# EAGLE design i2cspilcdbackpack (EAGLE 5.10)
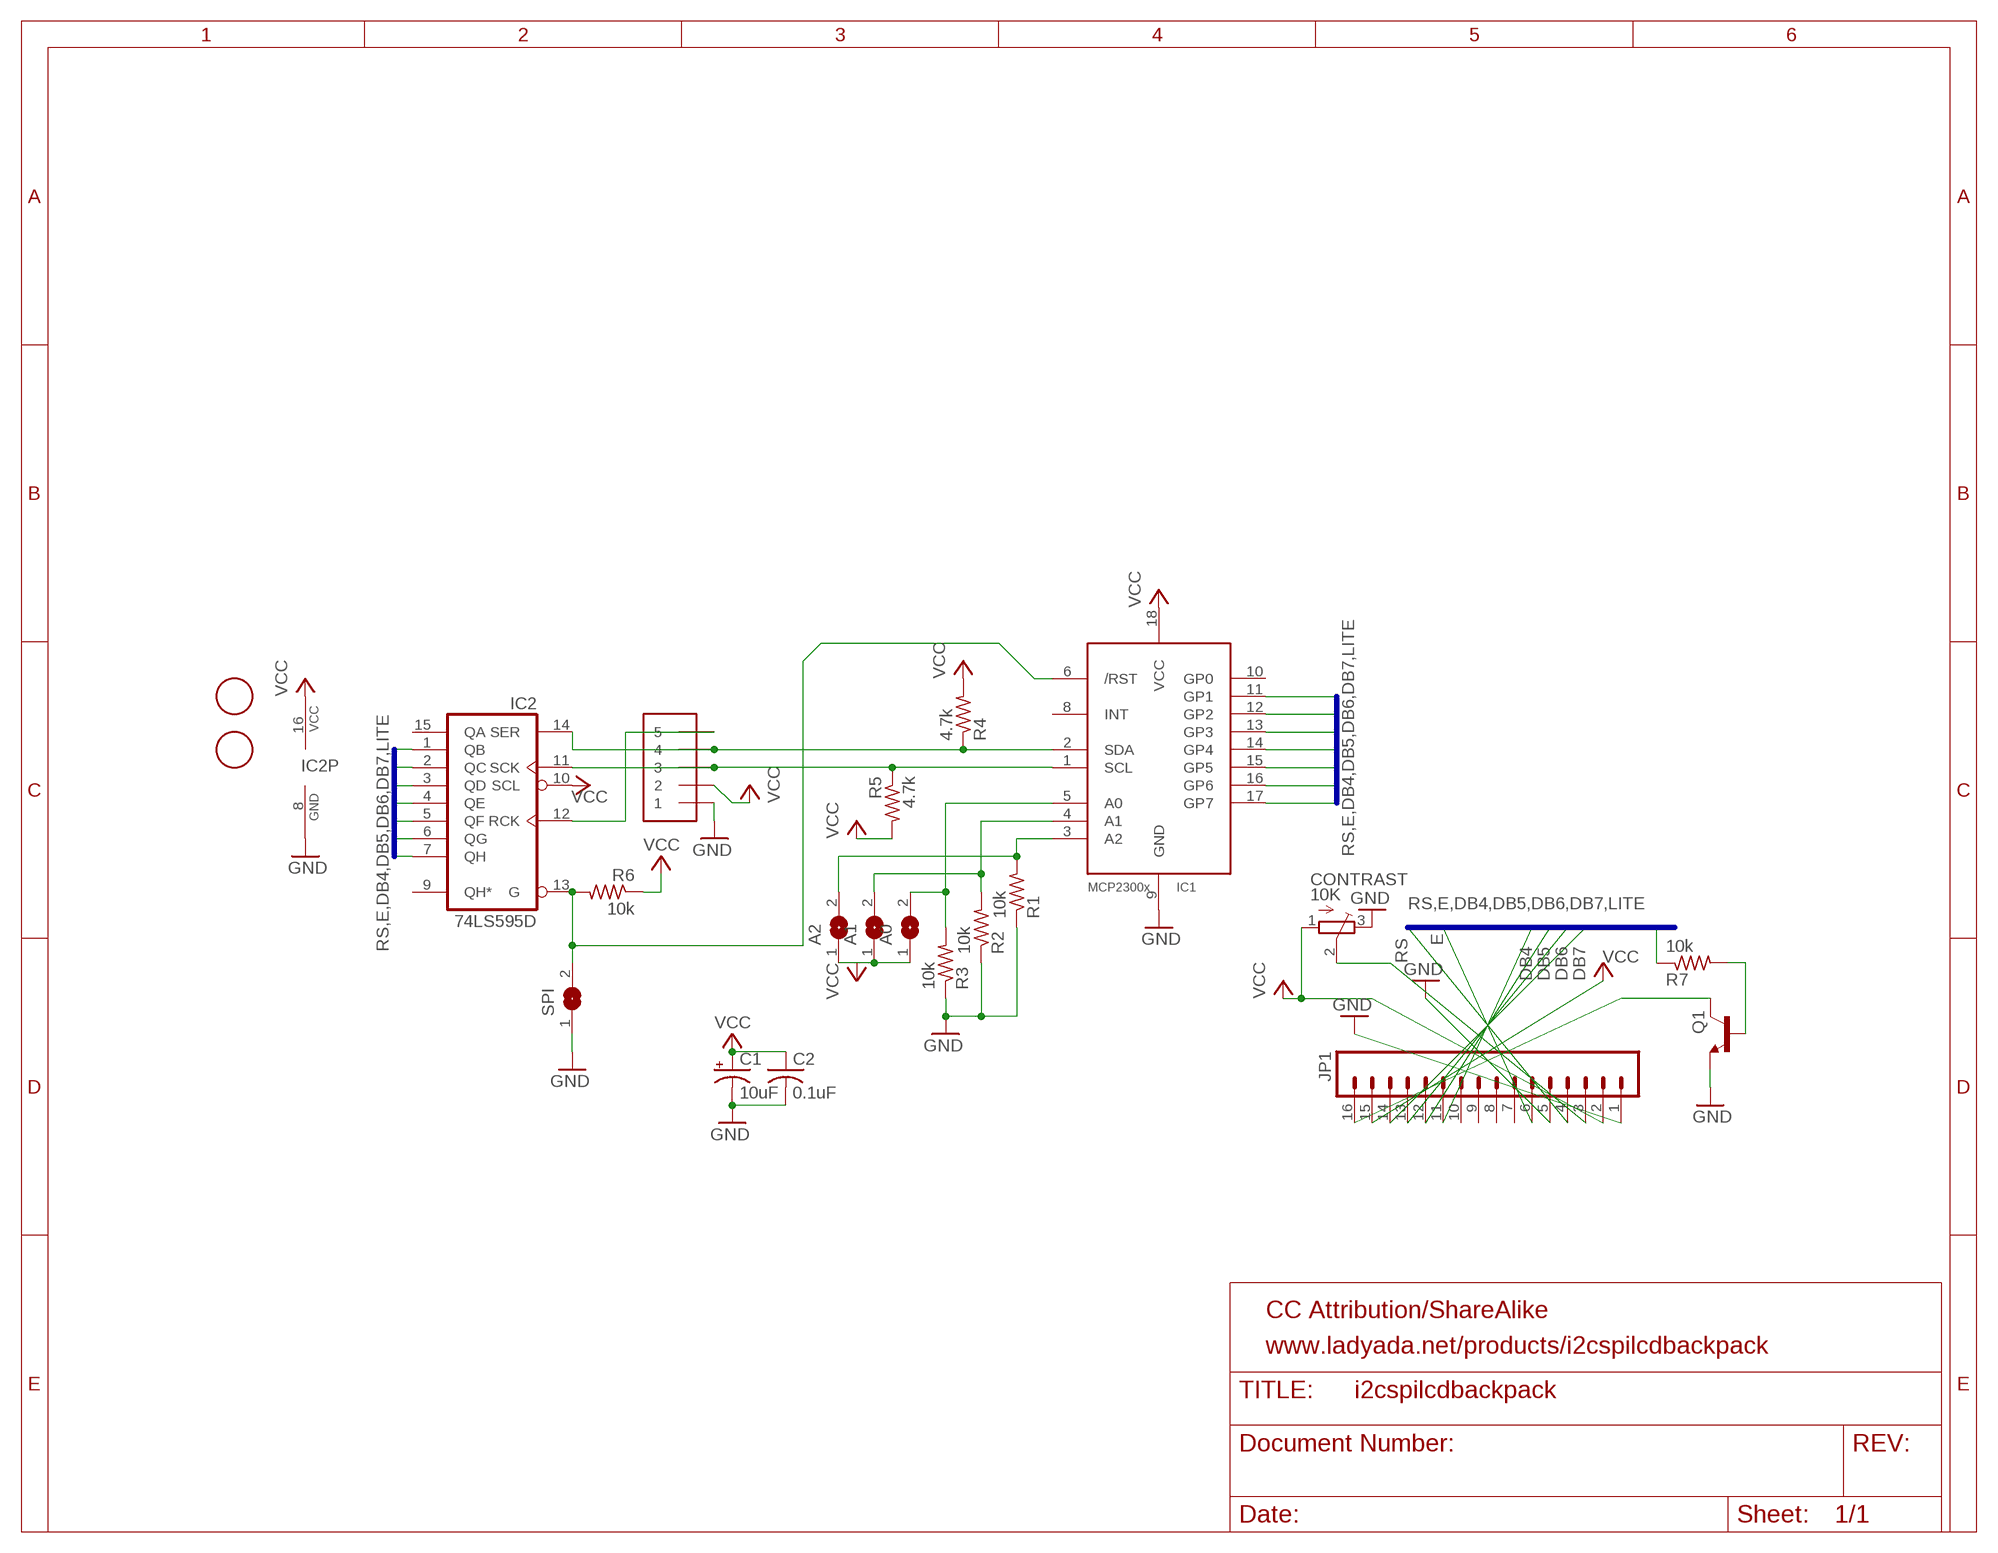
[diagram p0: schematic, sheet 1]

## Parts
A0  SJ  [SJ]
A1  SJ  [SJ]
A2  SJ  [SJ]
C1  10uF  CPOL-USA/3216-18R  [A/3216-18R]
C2  0.1uF  C-USC0805K  [C0805K]
CONTRAST  10K  TRIMPOTTC33X  [TC33X]
IC1  MCP2300X/SO  [SO18W]
IC2  74LS595D  [SO16]
J1  1X5  [3.5MM-5P]
JP1  M16LOCK_LONGPADS  [1X16_LOCK_LONGPADS]
Q1  MMBT2222ALT1-NPN-SOT23-BEC  [SOT23-BEC]
R1  10k  R-US_R0805  [R0805]
R2  10k  R-US_R0805  [R0805]
R3  10k  R-US_R0805  [R0805]
R4  4.7k  R-US_R0805  [R0805]
R5  4.7k  R-US_R0805  [R0805]
R6  10k  R-US_R0805  [R0805]
R7  10k  R-US_R0805  [R0805]
SPI  SJ  [SJ]
U$1  FIDUCIAL  [FIDUCIAL_1MM]
U$2  FIDUCIAL  [FIDUCIAL_1MM]

## Nets
CLOCK: IC1.1(SCL) IC2.11(SCK) J1.3 R5.1
DATA: IC1.2(SDA) IC2.14(SER) J1.4 R4.1
DB4: IC1.13(GP3) IC2.6(QG) JP1.11
DB5: IC1.14(GP4) IC2.5(QF) JP1.12
DB6: IC1.15(GP5) IC2.4(QE) JP1.13
DB7: IC1.16(GP6) IC2.3(QD) JP1.14
E: IC1.12(GP2) IC2.2(QC) JP1.6
GND: C1.- C2.2 CONTRAST.3(E) IC1.9(GND) IC2.8(GND) J1.1 JP1.1 JP1.5 Q1.E R1.1 R2.1 R3.1 SPI.1
LATCH: IC2.12(RCK) J1.5
LITE: IC1.17(GP7) IC2.7(QH) R7.1
N$1: A0.2 IC1.5(A0) R3.2
N$2: A1.2 IC1.4(A1) R2.2
N$3: A2.2 IC1.3(A2) R1.2
N$6: IC1.6(/RST) IC2.13(G) R6.2 SPI.2
N$7: JP1.16 Q1.C
N$9: Q1.B R7.2
N$10: CONTRAST.2(S) JP1.3
RS: IC1.11(GP1) IC2.1(QB) JP1.4
VCC: A0.1 A1.1 A2.1 C1.+ C2.1 CONTRAST.1(A) IC1.18(VCC) IC2.10(SCL) IC2.16(VCC) J1.2 JP1.2 JP1.15 R4.2 R5.2 R6.1
Unconnected: IC1.8(INT) IC1.10(GP0) IC2.9(QH*) IC2.15(QA) JP1.7 JP1.8 JP1.9 JP1.10

## Buses
RS,E,DB4,DB5,DB6,DB7,LITE

## Notes on the sheet
- CC Attribution/ShareAlike
- www.ladyada.net/products/i2cspilcdbackpack

## Library data of the parts
A0 A1 A2 SPI = jumper:SJ: SMD solder JUMPER
C1 = adafruit:CPOL-US: POLARIZED CAPACITOR, American symbol
C2 = adafruit:C-US: CAPACITOR, American symbol
CONTRAST = adafruit:TRIMPOT: SMT trimmer potentiometer part number TC33X http://www.ladyada.net/library/eagle
IC1 = adafruit:MCP2300X: MCP23008 Inexpensive i2c i/o expander - 8 general purpose i/o pins with optional pullups
IC2 = 74xx-us:74*595: 8-bit SHIFT REGISTER, output latch
J1 = adafruit:1X5
JP1 = SparkFun:M16
Q1 = transistor:*-NPN-: NPN Transistror BF959 corrected 2008.03.06
R1-R7 = adafruit:R-US_: RESISTOR, American symbol
U$1 U$2 = adafruit:FIDUCIAL: For use by pick and place machines to calibrate the vision/machine, 1mm By microbuilder.eu

## Board
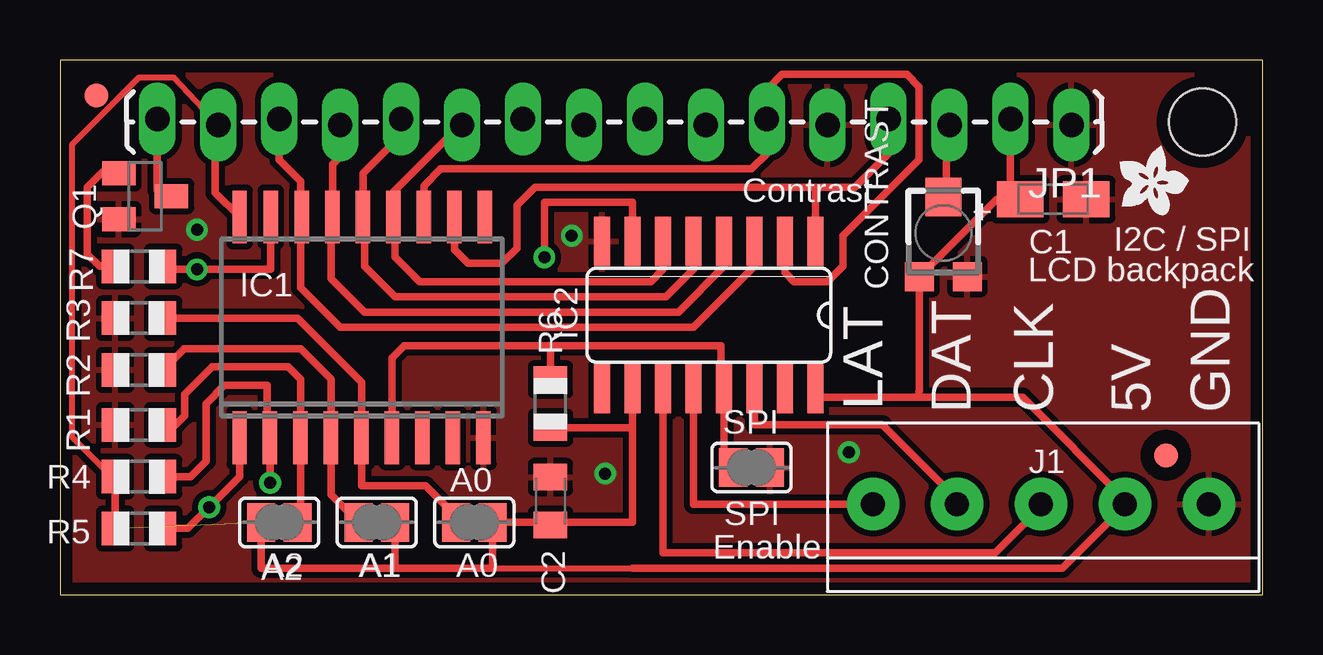
[diagram p1: board, top side]
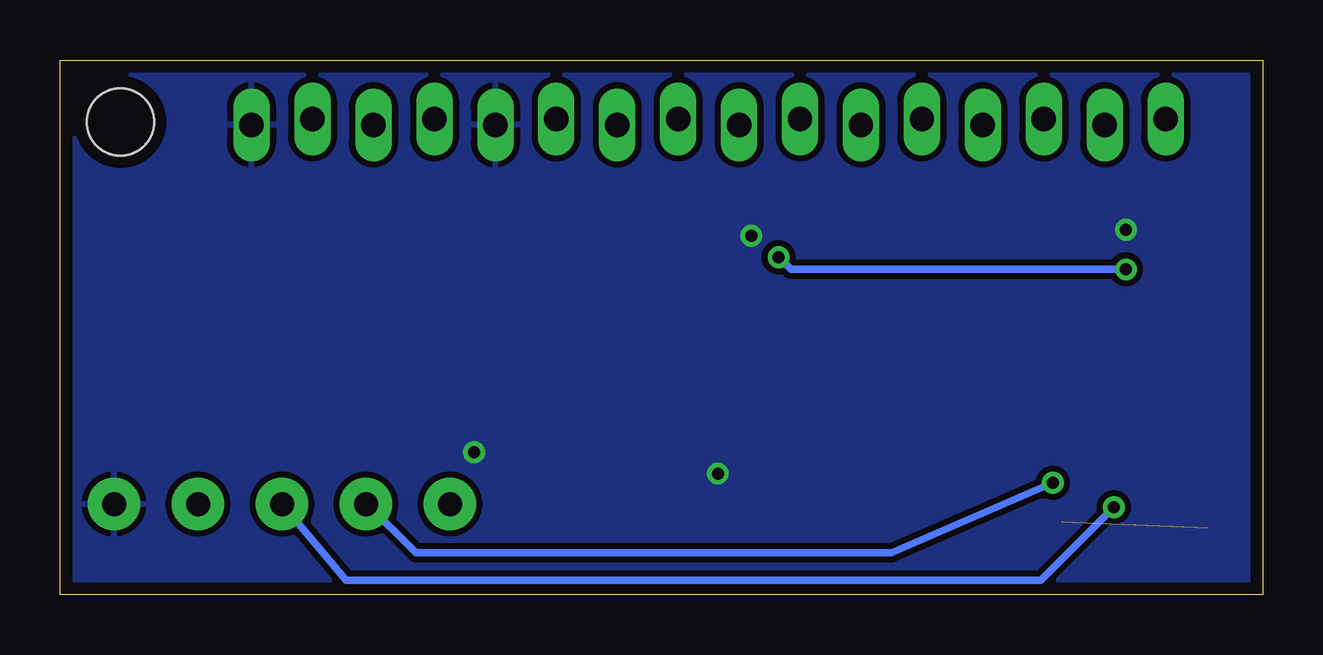
[diagram p2: board, bottom side, seen from below]

Size 50.14 x 22.28 mm. Coordinates in mm from the lower left corner, seen from the top.
Outline: 0,0 50.14,0 50.14,22.28 0,22.28 0,0
Copper layers (1*16): Top 0.035mm / dielectric 1.5mm / Bottom 0.035mm
Design rules "default *": minimum track width 10mil, minimum drill 19mil, track to track 10mil, track to pad 10mil, pad to pad 10mil, via to via 10mil, smd to smd 10mil, copper to edge 20mil, drill to drill 8mil, minimum pad ring 10mil, minimum via ring 8mil, stop-mask expansion 4mil, vias tented up to drill 20mil, thermal gap 10mil
Holes 2.8 mm at 47.62,19.7

### Footprints (pad centres in the part's own frame; a part is rotated, then mirrored left to right if it is on the bottom)
SJ = smd 1.168 x 1.6: 1 -0.762,0; 2 0.762,0
A/3216-18R = smd 1.95 x 1.5: + 1.375,0; - -1.375,0
C0805K = smd 1.1 x 1.4: 1 -1,0; 2 1,0
TC33X = smd 1.2 x 1.2: 1 -1,-1.825; 3 1,-1.825 | smd 1.5 x 1.6: 2 0,1.5
SO18W = smd 0.6 x 2.2: 1 -4.445,-4.6; 2 -3.175,-4.6; 3 -1.905,-4.6; 4 -0.635,-4.6; 5 0.635,-4.6; 6 1.905,-4.6; 7 3.175,-4.6; 8 4.445,-4.6; 9 5.715,-4.6; 10 5.775,4.6; 11 4.505,4.6; 12 3.235,4.6; 13 1.965,4.6; 14 0.695,4.6; 15 -0.575,4.6; 16 -1.845,4.6; 17 -3.145,4.6; 18 -4.445,4.6
SO16 = smd 0.66 x 2.032: 1 -4.445,-3.073; 2 -3.175,-3.073; 3 -1.905,-3.073; 4 -0.635,-3.073; 5 0.635,-3.073; 6 1.905,-3.073; 7 3.175,-3.073; 8 4.445,-3.073; 9 4.445,3.073; 10 3.175,3.073; 11 1.905,3.073; 12 0.635,3.073; 13 -0.635,3.073; 14 -1.905,3.073; 15 -3.175,3.073; 16 -4.445,3.073
3.5MM-5P = drill 1 pad 2.184 round: 1 7,0; 2 3.5,0; 3 0,0; 4 -3.5,0; 5 -7,0
1X16_LOCK_LONGPADS = drill 1.016 long: 1 0,0.127; 2 2.54,-0.127; 3 5.08,0.127; 4 7.62,-0.127; 5 10.16,0.127; 6 12.7,-0.127; 7 15.24,0.127; 8 17.78,-0.127; 9 20.32,0.127; 10 22.86,-0.127; 11 25.4,0.127; 12 27.94,-0.127; 13 30.48,0.127; 14 33.02,-0.127; 15 35.56,0.127; 16 38.1,-0.127
SOT23-BEC = smd 1 x 1.4: B -0.95,-1.1; C 0,1.1; E 0.95,-1.1
R0805 = smd 1.1 x 1.4: 1 -1,0; 2 1,0
FIDUCIAL_1MM = smd 1 x 1: 1 0,0

### Placement (x,y rotation side)
A0  17.27,3.01 180 top
A1  13.2,3.01 180 top
A2  9.14,3.01 0 top
C1  41.4,16.47 180 top
C2  20.44,3.9 90 top
CONTRAST  36.82,15.07 0 top
IC1  11.93,11.14 0 top
IC2  27.05,11.65 180 top
J1  40.89,3.77 0 top
JP1  42.16,19.7 180 top
Q1  3.55,16.6 270 top
R1  3.3,7.07 0 top
R2  3.3,9.36 0 top
R3  3.3,11.52 0 top
R4  3.3,4.92 180 top
R5  3.3,2.76 180 top
R6  20.44,7.96 90 top
R7  3.3,13.68 180 top
SPI  28.82,5.3 180 top
U$1  1.52,20.79 0 top
U$2  46.1,5.8 0 top
U$3  [ADAFRUIT200MIL]  45.59,17.36 270 top

### Tracks (layer width: path | path; a pad name or v marks a point on that pad's centre or on a via)
CLOCK  (via drill 0.5)
  Top 0.305: R5.1 5.33,2.76 v6.22,3.65 7.49,4.92 IC1.1 7.49,6.57 | IC2.11 25.14,1.74 38.98,1.74 40.89,3.65 J1.3
  Bottom 0.305: v6.22,3.65 9.27,0.6 38.22,0.6 J1.3
DATA  (via drill 0.5)
  Top 0.305: R4.1 5.46,4.92 6.09,5.55 6.09,7.96 6.85,8.72 8.63,8.72 8.63,6.44 8.73,6.54 IC1.2 v8.76,4.66 | IC2.14 28.95,7.07 34.28,7.07 37.39,3.97 J1.4
  Bottom 0.305: v8.76,4.66 15.49,1.74 35.3,1.74 37.46,3.9 37.39,3.9 J1.4
DB4
  Top 0.305: JP1.11 16.76,19.65 13.9,16.79 IC1.13 13.87,15.74 13.84,15.71 13.96,15.58 13.96,14.06 14.98,13.04 24.63,13.04 25.14,13.55 IC2.6
DB5
  Top 0.305: JP1.12 14.14,19.7 13.96,19.52 13.96,18.88 12.63,17.55 IC1.14 12.63,15.65 12.69,15.58 12.69,13.68 13.96,12.41 25.27,12.41 26.41,13.55 IC2.5
DB6
  Top 0.305: JP1.13 11.6,19.7 11.55,19.65 11.68,19.52 11.68,18.25 11.36,17.93 IC1.15 11.36,15.52 11.3,15.46 11.3,13.17 12.69,11.77 25.78,11.77 27.68,13.68 IC2.4
DB7
  Top 0.305: JP1.14 9.14,18.12 10.03,17.23 10.03,15.71 10.09,15.65 | 10.09,15.65 10.15,15.58 | 10.09,15.65 IC1.16 10.09,15.52 10.03,15.46 10.03,12.79 11.68,11.14 26.41,11.14 28.95,13.68 IC2.3
E
  Top 0.305: IC1.12 15.17,17.04 15.87,17.74 28.82,17.74 29.46,18.38 JP1.6 29.46,21.04 30.09,21.68 35.3,21.68 35.81,21.17 35.81,18.12 32.63,14.95 32.63,13.68 32,13.04 30.6,13.04 30.22,13.42 IC2.2
GND  (via drill 0.5)
  Top 0.305: R2.1 2.28,9.36
  other vias: 21.33,14.95 5.71,15.2 22.73,5.04 32.89,5.93
  pour Bottom: -0.64,22.57 -0.64,-0.29 50.29,-0.29 50.29,22.57
  pour Top: -1.4,22.7 -1.02,-0.04 50.54,-0.04 50.16,22.7
LATCH
  Top 0.305: J1.5 26.41,3.77 IC2.12
LITE  (via drill 0.5)
  Top 0.305: R7.1 4.3,13.55 v5.71,13.55 | v5.71,13.55 8.79,13.55 8.79,13.68 8.76,13.68 | IC2.7 23.87,16.34 20.19,16.34 v20.19,14.06 | IC1.17 8.79,13.58 v5.71,13.55
  Bottom 0.305: v5.71,13.55 19.68,13.55 v20.19,14.06
N$1
  Top 0.305: A0.2 16.63,3.14 15.23,4.53 12.57,4.53 IC1.5 12.57,8.85 9.9,11.52 R3.2
N$2
  Top 0.305: 11.3,6.57 IC1.4 11.3,6.31 | A1.2 11.3,4.15 11.3,6.31 | R2.2 5.19,10.25 10.03,10.25 11.3,8.98 11.3,6.31
N$3
  Top 0.305: R1.2 4.82,7.07 5.2,7.46 5.2,8.34 6.34,9.49 9.52,9.49 10.03,8.98 10.03,6.69 | 10.03,6.69 10.15,6.57 10.13,6.54 IC1.3 10.03,6.69 | A2.2 10.03,3.14 10.03,6.69
N$6
  Top 0.305: 28.32,5.55 SPI.2 28.32,5.3 27.68,5.93 IC2.13 27.66,8.6 27.55,8.6 27.55,10.38 20.44,10.38 | IC1.6 13.84,9.87 14.35,10.38 20.44,10.38 | 20.44,10.38 R6.2
N$7
  Top 0.305: Q1.C 4.31,16.6 4.06,16.85 JP1.16
N$9
  Top 0.305: R7.2 1.65,13.68 1.14,14.19 1.14,16.98 1.77,17.61 2.41,17.61 2.45,17.57 Q1.B
N$10
  Top 0.305: JP1.3 37.03,19.65 36.95,19.65 36.95,16.7 CONTRAST.2
RS
  Top 0.305: JP1.4 34.54,19.65 34.41,19.52 34.54,19.39 34.54,18.38 33.14,16.98 31.49,16.98 | IC1.11 16.44,14.38 17.01,13.8 18.41,13.8 19.05,14.44 19.05,16.22 19.81,16.98 31.49,16.98 | 31.49,16.98 IC2.1
VCC  (1 unrouted)
  Top 0.254: 2.41,5.04 2.03,5.04 0.5,6.57 0.5,18.76 3.3,21.55 4.75,21.55 JP1.15 | 23.87,1.1 18.16,1.1 18.03,1.23
  Top 0.305: JP1.15 6.55,19.65 6.47,19.65 6.47,16.75 IC1.18 | A2.1 8.38,1.1 13.96,1.1 | 13.96,3.14 A1.1 13.96,1.1 | 13.96,1.1 18.03,1.1 18.03,1.23 A0.1 20.44,3.01 | R5.2 R4.2 2.3,5.04 2.41,5.04 | JP1.2 39.62,16.88 C1.+ 39.05,16.47 CONTRAST.1 35.82,8.49 35.81,8.47 35.81,8.22 | 23.87,8.72 IC2.10 23.87,6.95 | 31.62,8.57 IC2.16 | 31.62,8.57 31.62,9.38 | J1.2 44.39,4.08 | 23.87,6.95 23.87,3.01 20.44,3.01 | 23.87,1.1 41.78,1.1 44.45,3.77 J1.2 | 20.44,3.01 C2.1 | R6.1 20.46,6.95 23.87,6.95 | 31.62,8.57 31.62,8.22 35.81,8.22 | J1.2 44.39,3.84 44.45,3.9 40.13,8.22 35.81,8.22

### Text on the board
tPlace: Contrast | I2C / SPI | LCD backpack | LAT | DAT | CLK | 5V | GND | SPI | Enable | A2 | A1 | A0